# EAGLE design RS232toTTL_Rev2 (EAGLE 6.0)
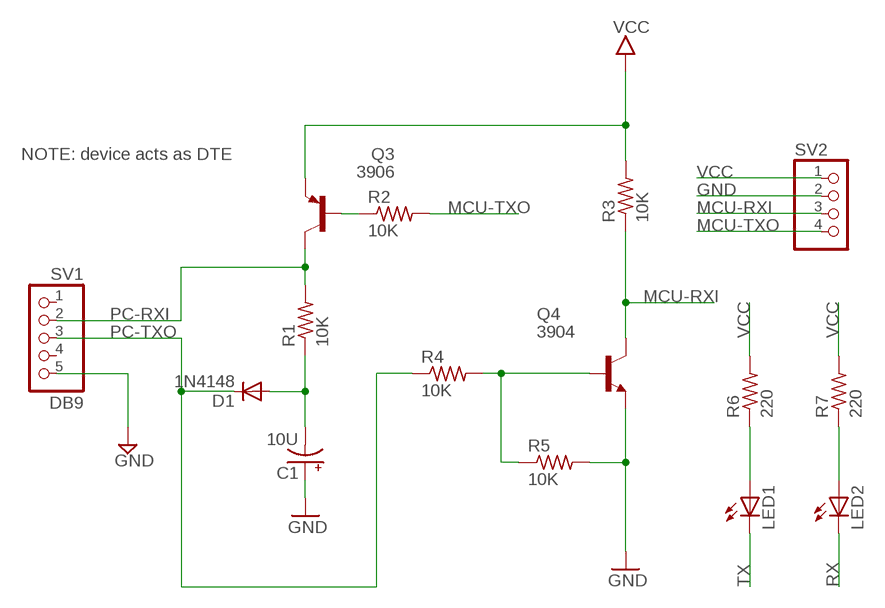
[diagram p0: schematic, sheet 1]

## Parts
C1  10U  CPOL-USE2.5-5  [E2,5-5]
D1  1N4148  1N4148DO35-7  [DO35-7]
LED1  LED3MM  [LED3MM]
LED2  LED3MM  [LED3MM]
Q3  3906  2N3906INLINE  [TO92-CBE]
Q4  3904  2N3904INLINE  [TO92-CBE]
R1  10K  R-US_0204/5  [0204/5]
R2  10K  R-US_0204/5  [0204/5]
R3  10K  R-US_0204/5  [0204/5]
R4  10K  R-US_0204/5  [0204/5]
R5  10K  R-US_0204/5  [0204/5]
R6  220  R-US_0204/5  [0204/5]
R7  220  R-US_0204/5  [0204/5]
SV1  DB9  PINHD-1X05_2.54-S  [1X05-S]
SV2  PINHD-1X04_2.54-S  [1X04-S]

## Nets
GND: C1.+ Q4.E R5.2 SV1.5 SV2.2
MCU-RXI: Q4.C R3.1 SV2.3
MCU-TXO: R2.2 SV2.4
N$1: Q4.B R4.2 R5.1
N$3: Q3.B R2.1
N$6: LED1.A R6.1
N$7: C1.- D1.A R1.1
N$9: LED2.A R7.1
PC-RXI: Q3.C R1.2 SV1.2
PC-TXO: D1.C R4.1 SV1.3
RX: LED2.K(C)
TX: LED1.K(C)
VCC: Q3.E R3.2 R6.2 R7.2 SV2.1
Unconnected: SV1.1 SV1.4

## Notes on the sheet
- NOTE: device acts as DTE

## Library data of the parts
C1 = rcl:CPOL-US: POLARIZED CAPACITOR, American symbol
D1 = diode:1N4148: DIODE high speed (Philips)
LED1 LED2 = led:LED: LED OSRAM: - CHIPLED LG R971, LG N971, LY N971, LG Q971, LY Q971, LO R971, LY R971 LH N974, LH R974 LS Q976, LO Q976, LY Q976 LO Q996 - Hyper CHIPLED LW Q18S LB Q993, LB Q99A, LB R99A - SideLED LS A670, LO A670, LY A670, LG A670, LP A670 LB A673, LV A673, LT A673, LW A673 LH A674 LY A675 LS A676, LA A676, LO A676, LY A676, LW A676 LS A679, LY A679, LG A679 - Hyper Micro SIDELED® LS Y876, LA Y876, LO Y876, LY Y876 LT Y87S - SmartLED LW L88C, LW L88S LB L89C, LB L89S, LG L890 LS L89K, LO L89K, LY L89K LS L896, LA L896, LO L896, LY L896 - TOPLED LS T670, LO T670, LY T670, LG T670, LP T670 LSG T670, LSP T670, LSY T670, LOP T670, LYG T670 LG T671, LOG T671, LSG T671 LB T673, LV T673, LT T673, LW T673 LH T674 LS T676, LA T676, LO T676, LY T676, LB T676, LH T676, LSB T676, LW T676 LB T67C, LV T67C, LT T67C, LS T67K, LO T67K, LY T67K, LW E67C LS E67B, LA E67B, LO E67B, LY E67B, LB E67C, LV E67C, LT E67C LW T67C LS T679, LY T679, LG T679 LS T770, LO T770, LY T770, LG T770, LP T770 LB T773, LV T773, LT T773, LW T773 LH T774 LS E675, LA E675, LY E675, LS T675 LS T776, LA T776, LO T776, LY T776, LB T776 LHGB T686 LT T68C, LB T68C - Hyper Mini TOPLED® LB M676 - Mini TOPLED Santana® LG M470 LS M47K, LO M47K, LY M47K Source: http://www.osram.convergy.de LUXEON: - LUMILED® LXK2-PW12-R00, LXK2-PW12-S00, LXK2-PW14-U00, LXK2-PW14-V00 LXK2-PM12-R00, LXK2-PM12-S00, LXK2-PM14-U00 LXK2-PE12-Q00, LXK2-PE12-R00, LXK2-PE12-S00, LXK2-PE14-T00, LXK2-PE14-U00 LXK2-PB12-K00, LXK2-PB12-L00, LXK2-PB12-M00, LXK2-PB14-N00, LXK2-PB14-P00, LXK2-PB14-Q00 LXK2-PR12-L00, LXK2-PR12-M00, LXK2-PR14-Q00, LXK2-PR14-R00 LXK2-PD12-Q00, LXK2-PD12-R00, LXK2-PD12-S00 LXK2-PH12-R00, LXK2-PH12-S00 LXK2-PL12-P00, LXK2-PL12-Q00, LXK2-PL12-R00 Source: www.luxeon.com KINGBRIGHT: KA-3528ASYC Source: www.kingbright.com
Q3 = mes_transistors:2N3906: PNP Transistor Small signal PNP Bipolar Junction Transistor (BJT). Use this device to represent any of a number of such transistors with similar package and pinout: 2N4402, 2N3906, etc.
Q4 = mes_transistors:2N3904: NPN Transistor Small signal NPN Bipolar Junction Transistor (BJT). Use this device to represent any of a number of such transistors with similar package and pinout: 2N4401, 2N3904, 2N2222, etc.
R1-R7 = rcl:R-US_: RESISTOR, American symbol
SV1 = pinhead-2:PINHD-1X05: PIN HEADER
SV2 = pinhead-2:PINHD-1X04: PIN HEADER

## Board
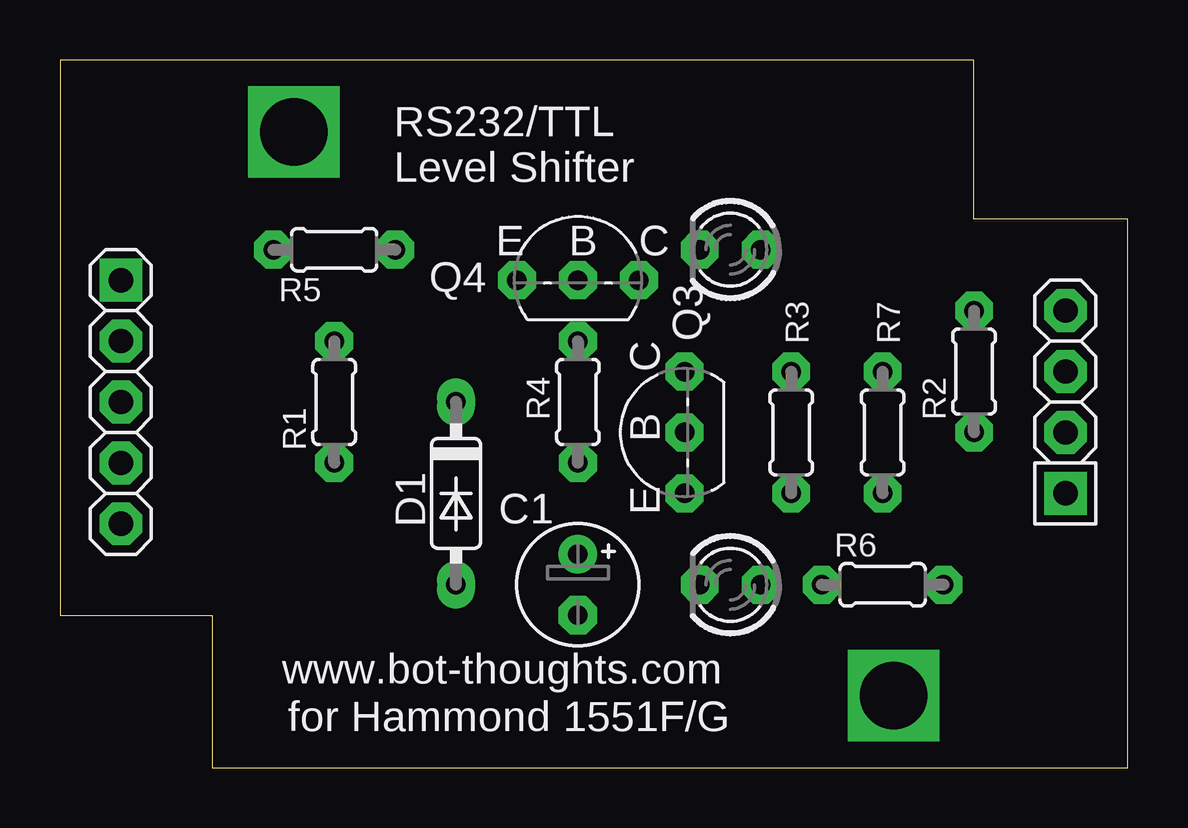
[diagram p1: board, top side]
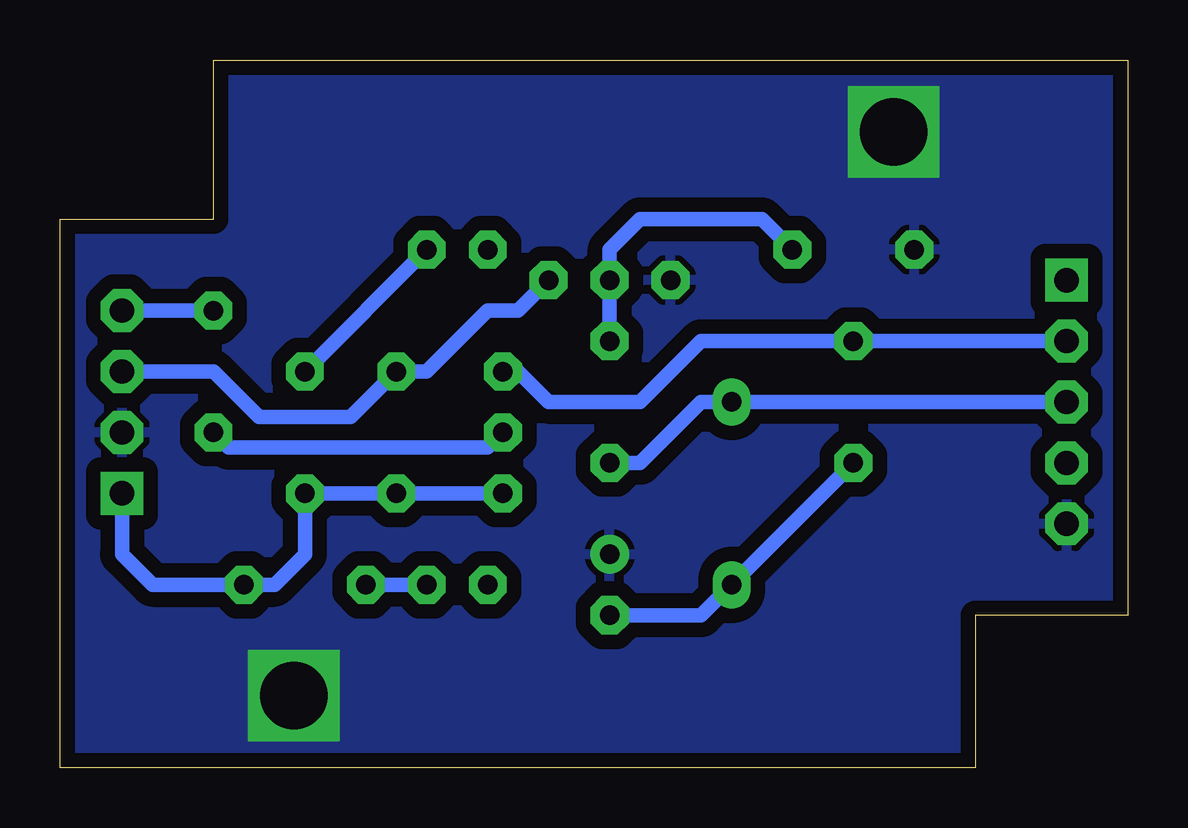
[diagram p2: board, bottom side, seen from below]

Size 44.5 x 29.5 mm. Coordinates in mm from the lower left corner, seen from the top.
Outline: 6.35,0 44.5,0 44.5,22.86 38.1,22.86 38.1,29.5 0,29.5 0,6.35 6.35,6.35 6.35,0
Copper layers (1*16): Top 0.0356mm / dielectric 1.5011mm / Bottom 0.0356mm
Design rules "LaenPCBOrder *": minimum track width 6mil, minimum drill 13mil, track to track 6mil, track to pad 6mil, pad to pad 6mil, via to via 6mil, smd to smd 6mil, copper to edge 15mil, drill to drill 6mil, minimum pad ring 15mil, minimum via ring 7mil, stop-mask expansion 4mil, vias tented up to drill 20mil, thermal gap 10mil

### Footprints (pad centres in the part's own frame; a part is rotated, then mirrored left to right if it is on the bottom)
E2,5-5 = drill 0.813 pad 1.6: + -1.27,0 | drill 0.813 pad 1.6 octagon: - 1.27,0
DO35-7 = drill 0.813 long: A 3.81,0; C -3.81,0
LED3MM = drill 0.813 octagon: A -1.27,0; K 1.27,0
TO92-CBE = drill 0.813 octagon: B 0,0; C 2.54,0; E -2.54,0
0204/5 = drill 0.813 octagon: 1 -2.54,0; 2 2.54,0
1X05-S = drill 1.016 square: 1 -5.08,0 | drill 1.016 octagon: 2 -2.54,0; 3 0,0; 4 2.54,0; 5 5.08,0
1X04-S = drill 1.016 square: 1 -3.81,0 | drill 1.016 octagon: 2 -1.27,0; 3 1.27,0; 4 3.81,0

### Placement (x,y rotation side)
C1  21.59,7.62 270 top
D1  16.51,11.43 270 top
LED1  27.94,7.62 180 top
LED2  27.94,21.59 180 top
Q3  26.04,13.97 90 top
Q4  21.59,20.32 0 top
R1  11.43,15.24 90 top
R2  38.1,16.51 90 top
R3  30.48,13.97 270 top
R4  21.59,15.24 90 top
R5  11.43,21.59 180 top
R6  34.29,7.62 0 top
R7  34.29,13.97 270 top
SV1  2.54,15.24 270 top
SV2  41.91,15.24 90 top

### Tracks (layer width: path | path; a pad name or v marks a point on that pad's centre or on a via)
GND  (via drill 2.8)
  other vias: 9.75,26.5 34.75,3
  pour Bottom (isolate 0.61): 0,29.5 44.5,29.5 44.5,0 0,0
MCU-RXI
  Bottom 0.61: SV2.3 38.1,16.51 36.2,14.61 32.38,14.61 R3.1 29.21,16.51 26.67,19.05 25.4,19.05 Q4.C
MCU-TXO
  Bottom 0.61: SV2.4 R2.2
N$1
  Bottom 0.61: R5.1 15.24,22.86 20.32,22.86 21.59,21.59 Q4.B R4.2
N$3
  Bottom 0.61: R2.1 37.47,13.34 26.67,13.34 Q3.B
N$6
  Bottom 0.61: LED1.A R6.1
N$7
  Bottom 0.61: R1.1 D1.A 17.78,6.35 C1.-
N$9
  Bottom 0.61: R7.1 LED2.A
PC-RXI
  Bottom 0.61: SV1.2 R1.2 17.78,17.78 20.32,15.24 24.13,15.24 25.4,16.51 Q3.C
PC-TXO
  Bottom 0.61: SV1.3 D1.C 17.78,15.24 20.32,12.7 R4.1
VCC
  Bottom 0.61: SV2.1 41.91,8.89 40.64,7.62 R6.2 35.56,7.62 34.29,8.89 R7.2 R3.2 Q3.E

### Text on the board
tNames: RS232/TTL | Level Shifter | www.bot-thoughts.com | for Hammond 1551F/G